# EAGLE schematic SOT-23 (EAGLE 6.4)
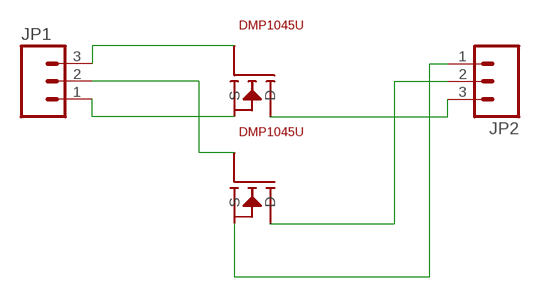
[diagram p0: schematic, sheet 1]

## Parts
JP1  M03LOCK  [1X03_LOCK]
JP2  M03LOCK  [1X03_LOCK]
U$1  DMP1045U  [SOT-23]
U$2  DMP1045U  [SOT-23]

## Nets
D: JP2.3 U$1.3(D)
D2: JP2.2 U$2.3(D)
G: JP1.3 U$1.1(G)
G2: JP1.2 U$2.1(G)
S: JP1.1 U$1.2(S)
S2: JP2.1 U$2.2(S)

## Library data of the parts
JP1 JP2 = SparkFun:M03: Header 3 Standard 3-pin 0.1" header. Use with straight break away headers (SKU : PRT-00116), right angle break away headers (PRT-00553), swiss pins (PRT-00743), machine pins (PRT-00117), and female headers (PRT-00115). Molex polarized connector foot print use with SKU : PRT-08232 with associated crimp pins and housings.
U$1 U$2 = zak:DMP1045U